# Altium schematic sheet 06-CM4_USB_HDMI_SDCard.SchDoc
size B; SheetNumber: 6; SheetTotal: 11
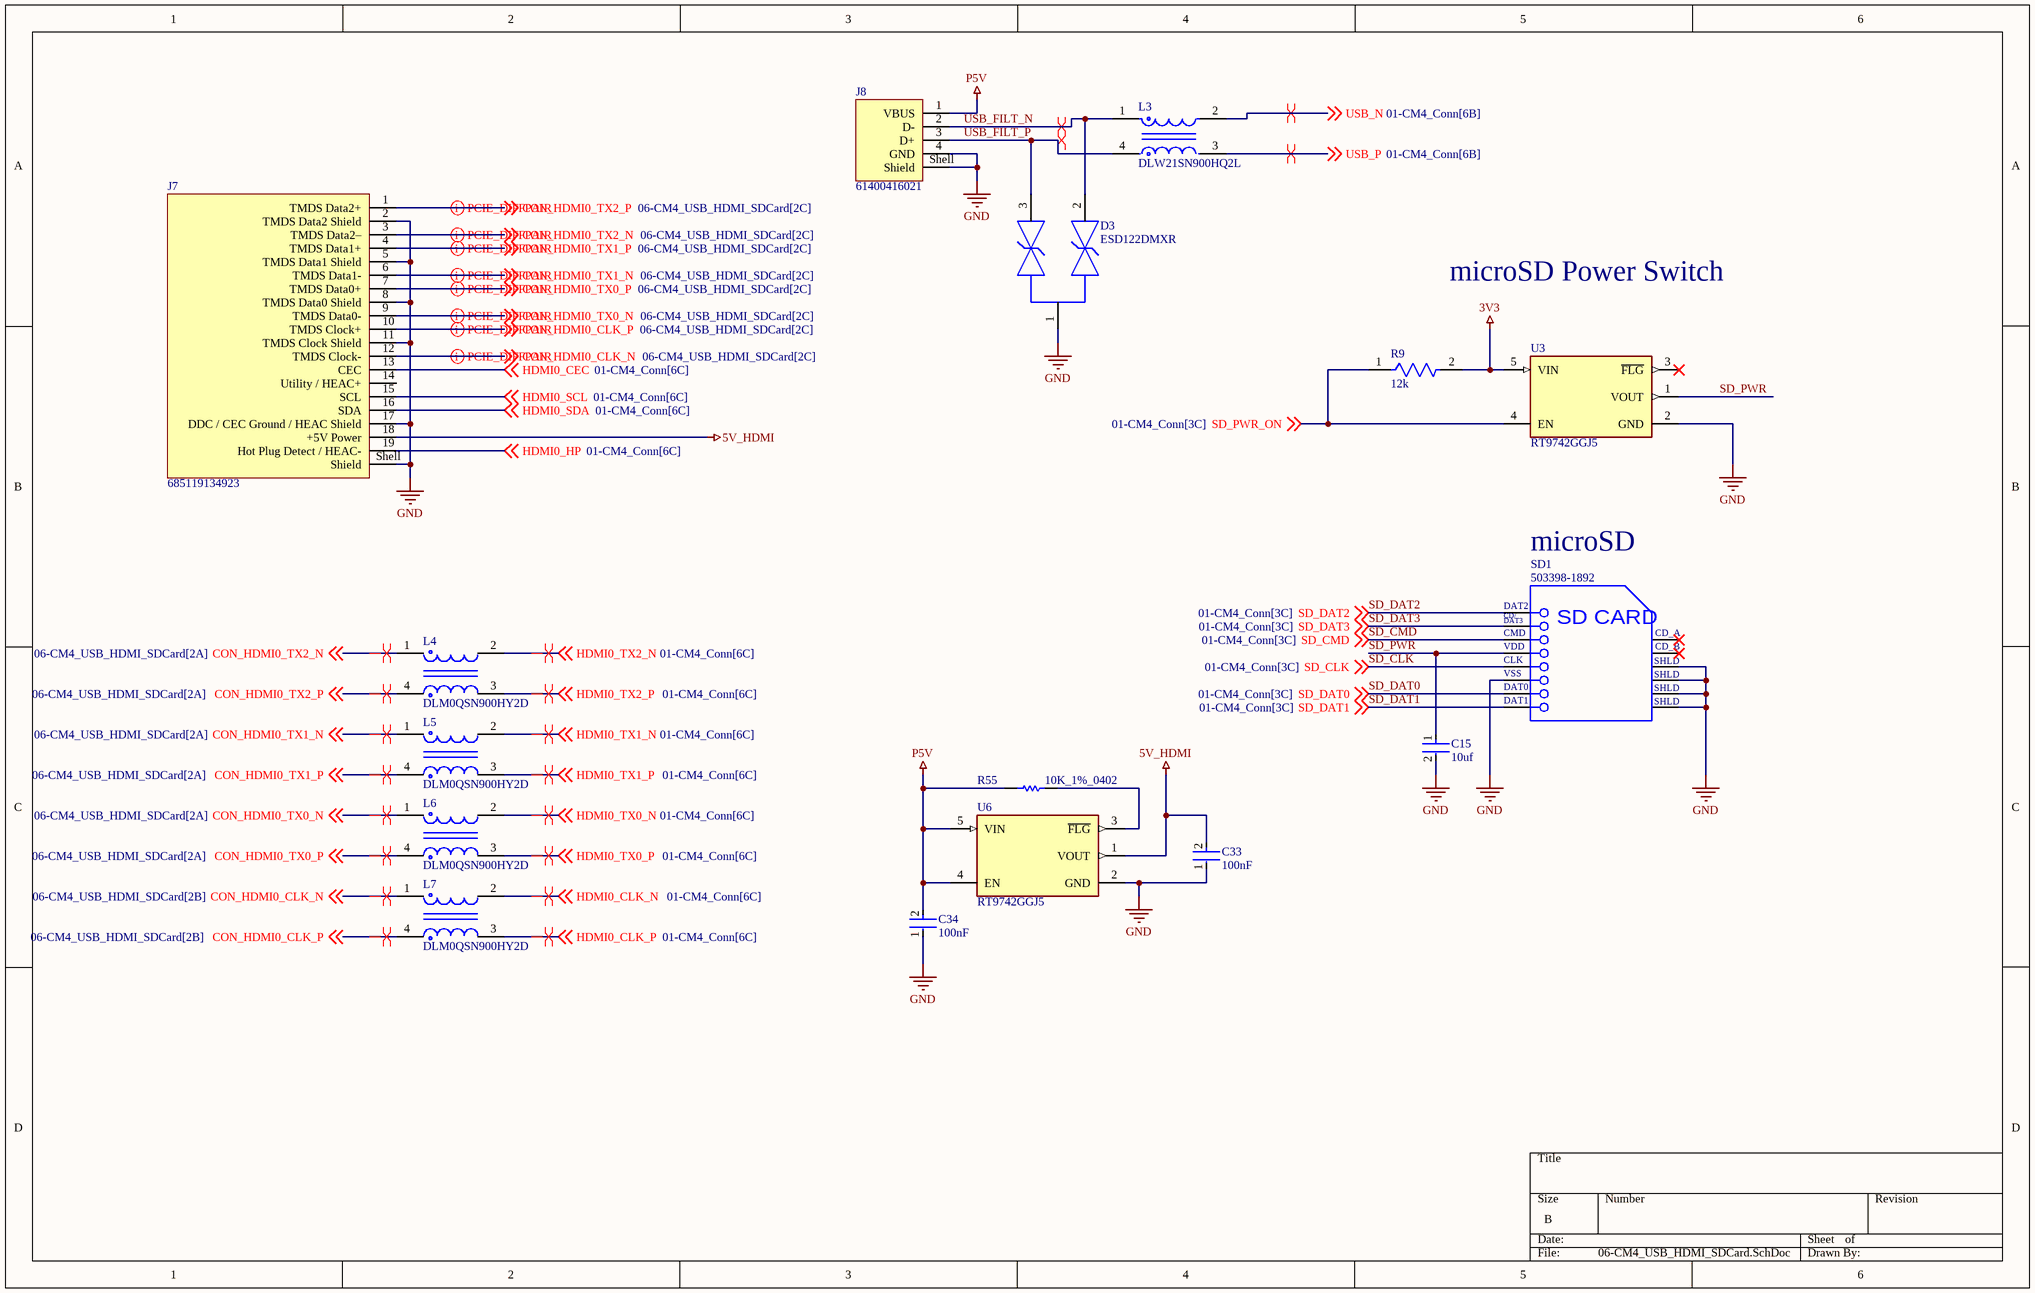
[diagram p0: 06-CM4_USB_HDMI_SDCard.SchDoc]

## Parts
C15  10uf  [FP-GRM188-0_2-IPC_C]
C33  100nF  [FP-GRM15-MFG]
C34  100nF  [FP-GRM15-MFG]
D3  ESD122DMXR  [FP-DMX0003A-MFG]
J7  685119134923  [685119134923]
J8  61400416021  [61400416021]
L3  DLW21SN900HQ2L  [FP-DLW21S-MFG]
L4  DLM0QSN900HY2D  [FP-DLM0Q-MFG]
L5  DLM0QSN900HY2D  [FP-DLM0Q-MFG]
L6  DLM0QSN900HY2D  [FP-DLM0Q-MFG]
L7  DLM0QSN900HY2D  [FP-DLM0Q-MFG]
R9  12k  [FP-RC0402-0_4-IPC_C]
R55  10K_1%_0402  [RESC1005X40X25NL10T10]
SD1  503398-1892  [MOLX-503398-1892_V]
U3  RT9742GGJ5  [FP-RT9742GGJ5-IPC_C]
U6  RT9742GGJ5  [FP-RT9742GGJ5-IPC_C]

## Nets
3V3: R9.2 U3.5(VIN)
5V_HDMI: C33.2 J7.18(+5V_Power) U6.1(VOUT)
GND: C15.2 C33.1 C34.1 D3.1(GND) J7.2(TMDS_Data2_Shield) J7.5(TMDS_Data1_Shield) J7.8(TMDS_Data0_Shield) J7.11(TMDS_Clock_Shield) J7.17(DDC_/_CEC_Ground_/_HEAC_Shield) J7.Shell(Shield) J8.4(GND) J8.Shell(Shield) SD1.6(VSS) SD1.11(SHLD) SD1.12(SHLD) SD1.13(SHLD) SD1.14(SHLD) U3.2(GND) U6.2(GND)
P5V: C34.2 J8.1(VBUS) R55.1 U6.4(EN) U6.5(VIN)
CON_HDMI0_CLK_N: J7.12(TMDS_Clock-) L7.1 ; off-sheet CON_HDMI0_CLK_N
CON_HDMI0_CLK_P: J7.10(TMDS_Clock+) L7.4 ; off-sheet CON_HDMI0_CLK_P
CON_HDMI0_TX0_N: J7.9(TMDS_Data0-) L6.1 ; off-sheet CON_HDMI0_TX0_N
CON_HDMI0_TX0_P: J7.7(TMDS_Data0+) L6.4 ; off-sheet CON_HDMI0_TX0_P
CON_HDMI0_TX1_N: J7.6(TMDS_Data1-) L5.1 ; off-sheet CON_HDMI0_TX1_N
CON_HDMI0_TX1_P: J7.4(TMDS_Data1+) L5.4 ; off-sheet CON_HDMI0_TX1_P
CON_HDMI0_TX2_N: J7.3(TMDS_Data2–) L4.1 ; off-sheet CON_HDMI0_TX2_N
CON_HDMI0_TX2_P: J7.1(TMDS_Data2+) L4.4 ; off-sheet CON_HDMI0_TX2_P
HDMI0_CEC: J7.13(CEC) ; off-sheet HDMI0_CEC
HDMI0_CLK_N: L7.2 ; off-sheet HDMI0_CLK_N
HDMI0_CLK_P: L7.3 ; off-sheet HDMI0_CLK_P
HDMI0_HP: J7.19(Hot_Plug_Detect_/_HEAC-) ; off-sheet HDMI0_HP
HDMI0_SCL: J7.15(SCL) ; off-sheet HDMI0_SCL
HDMI0_SDA: J7.16(SDA) ; off-sheet HDMI0_SDA
HDMI0_TX0_N: L6.2 ; off-sheet HDMI0_TX0_N
HDMI0_TX0_P: L6.3 ; off-sheet HDMI0_TX0_P
HDMI0_TX1_N: L5.2 ; off-sheet HDMI0_TX1_N
HDMI0_TX1_P: L5.3 ; off-sheet HDMI0_TX1_P
HDMI0_TX2_N: L4.2 ; off-sheet HDMI0_TX2_N
HDMI0_TX2_P: L4.3 ; off-sheet HDMI0_TX2_P
SD_CLK: SD1.5(CLK) ; off-sheet SD_CLK
SD_CMD: SD1.3(CMD) ; off-sheet SD_CMD
SD_DAT0: SD1.7(DAT0) ; off-sheet SD_DAT0
SD_DAT1: SD1.8(DAT1) ; off-sheet SD_DAT1
SD_DAT2: SD1.1(DAT2) ; off-sheet SD_DAT2
SD_DAT3: SD1.2(CD/DAT3) ; off-sheet SD_DAT3
SD_PWR: C15.1 SD1.4(VDD) U3.1(VOUT)
SD_PWR_ON: R9.1 U3.4(EN) ; off-sheet SD_PWR_ON
USB_FILT_N: D3.2(IO1) J8.2(D-) L3.1
USB_FILT_P: D3.3(IO2) J8.3(D+) L3.4
USB_N: L3.2 ; off-sheet USB_N
USB_P: L3.3 ; off-sheet USB_P
NetR55_2: R55.2 U6.3(~{FLG})

Not connected (* = marked no-connect by the designer): J7 14(Utility_/_HEAC+); SD1 9(CD_A)* 10(CD_B)*; U3 3(~{FLG})*

## Layout directives
differential pair; differential pair class HDMI: CON_HDMI0_CLK_N, CON_HDMI0_CLK_P, CON_HDMI0_TX0_N, CON_HDMI0_TX0_P, CON_HDMI0_TX1_N, CON_HDMI0_TX1_P, CON_HDMI0_TX2_N, CON_HDMI0_TX2_P
differential pair: CON_HDMI0_CLK_N, CON_HDMI0_CLK_P, CON_HDMI0_TX0_N, CON_HDMI0_TX0_P, CON_HDMI0_TX1_N, CON_HDMI0_TX1_P, CON_HDMI0_TX2_N, CON_HDMI0_TX2_P, HDMI0_CLK_N, HDMI0_CLK_P, HDMI0_TX0_N, HDMI0_TX0_P, HDMI0_TX1_N, HDMI0_TX1_P, HDMI0_TX2_N, HDMI0_TX2_P, USB_FILT_N, USB_FILT_P, USB_N, USB_P

## Notes on the sheet
- microSD Power Switch
- microSD
- (in symbol CMP-2000-05621-1) CD/; DAT3; SD CARD

## Library data of the parts
C15 = CMP-06035-045466-1: Chip Multilayer Ceramic Capacitors for General Purpose, 0603, 10uF, X5R, 15%, 20%, 35V; Case Code (Imperial): 0603; Voltage Rating (DC): 35V; Width: 0.031inch; Dielectric: X5R; Voltage Rating: 35V; Min Operating Temperature: -55°C; Thickness: 0.039inch; Mount: Surface Mount; Case/Package: 0603; Length: 0.063inch; Capacitance: 10uF; Max Operating Temperature: 85°C; Packaging: Tape and Reel; Tolerance: 20%; Case Code (Metric): 1608
C33 C34 = CMP-2100-03641-2: CAP CER 0.1UF 16V X7R 0402; Manufacturer Part Number: GRM155R71C104KA88D; Manufacturer: Murata; Standoff Height: 0mm; Tolerance: 10%; Voltage Rating: 16Vdc; Material: Ceramic; Capacitance: 0.10μF; Value: 0.10μF; RoHS: TRUE; Temperature Characteristic: X7R; Octopart: https://octopart.com/grm155r71c104ka88d-murata-196880; Digikey Description: CAP CER 0.1UF 16V X7R 0402; Device Class L3: Ceramic Capacitors; Height: 0.55mm; ComponentLink2Description: Datasheet; Temperature Range Low: -55°C; Ipc Land Pattern Name: CAPC10050X219; ComponentLink2URL: https://search.murata.co.jp/Ceramy/image/img/A01X/G101/ENG/GRM155R71H471KA01-01A.pdf; Device Class L1: Passive Components; Lead Free: yes; Category: Cap; Package: GRM15; Temperature: -55°C to +125°C; Device Class L2: Capacitors; Temperature Range High: +125°C; Mouser Description: 0402 0.1 uF 16V ±10 % Tolerance X7R SMT Multilayer Ceramic Capacitor
D3 = CMP-04989-000013-1: TVS DIODE 3.6V 8.4V 3X2SON; Peak Pulse Power: 20W; Min Breakdown Voltage: 5.1V; Average Rectified Current: 10A; Element Configuration: Common Cathode; Number of Channels: 2; Max Reverse Voltage (DC): 100V; Interface: USB; Power Line Protection: No; Peak Pulse Current: 2.5A; Clamping Voltage: 8.4V; Min Operating Temperature: -40°C; Number of Pins: 3; Resistor Type: Zener; Mount: Through Hole; Case/Package: TO-220-3; Reverse Standoff Voltage: 3.6V; RoHS Compliant: Yes; Max Operating Temperature: 125°C; Number of Bidirectional Channels: 2; Packaging: Rail/Tube
J7 = CMP-1502-00169-3: NexarPartId: 18818285; Connector Type: HDMI; Contact Resistance: 30mΩ; Current Rating: 500mA; Gender: Receptacle; Insulation Resistance: 10MΩ; Number of Contacts: 19; Body Material: Plastic; Voltage Rating: 40V; REACH SVHC: Unknown; Length: 12.15mm; Orientation: Horizontal; Packaging: Tape and Reel; Number of Pins: 19; Min Operating Temperature: -25°C; Termination: SMD/SMT; Height: 5.55mm; Features: Shielded; Number of Positions: 19; Width: 15mm; Mount: Horizontal, Surface Mount; Color: Black; Contact Material: Bronze, Gold; RoHS: Compliant; Max Operating Temperature: 85°C
J8 = CMP-1502-03227-2: NexarPartId: 21041530; Contact Resistance: 20mΩ; Gender: Receptacle; Voltage Rating (DC): 30V; Current Rating: 1.5A; Connector Type: USB; Insulation Resistance: 1GΩ; USB Standard: USB 2.0; Number of Contacts: 4; Number of Ports: 1; Width: 14.4mm; REACH SVHC: Unknown; Contact Plating: Gold; Length: 15.8mm; Lead Free: Lead Free; Max Operating Temperature: 105°C; Orientation: Horizontal; Contact Material: Copper; Voltage Rating: 30V; Min Operating Temperature: -40°C; Flammability Rating: UL94 V-0; Color: White; RoHS: Compliant; Number of Pins: 4; Mount: Horizontal, Through Hole; Number of Positions: 4; Operating Supply Voltage: 30V; Insulation Material: PBT; Termination: Solder
L3 = CMP-2000-06163-2: Common Mode Choke, 0805, 90Ω @ 100MHz, 0.41Ω, 25%, 280mA; Impedance: 90R; Shielding: Unshielded; DC Resistance (DCR): 410mR; Number of Lines: 2; RoHS Compliant: Yes; Series: EMIFIL®, DLW21S; Weight: 0.000388oz; Current Rating: 280mA; Case Code (Imperial): 0805; Termination: SMD/SMT; Lead Free: Lead Free; Width: 0.047inch; Height: 0.055inch; Package Quantity: 1; Radiation Hardening: No; Depth: 1.4mm; Packaging: Tape and Reel; Current: 280mA; REACH SVHC: No SVHC; Test Frequency: 100MHz; DC Current: 280mA; Max Operating Temperature: 85°C; Case/Package: 0805; Min Operating Temperature: -40°C; Max DC Current: 280mA; Tolerance: 25%; Resistor Type: Wirewound; Length: 2mm; Mount: Surface Mount; Military Standard: Not
L4-L7 = CMP-06045-000424-1: Chip Common Mode Choke Coil Monolithic 025020 50mA 90Ohm @ 100MHz; Impedance: 90R; Length: 650um; Width: 500um
R9 = CMP-2002-07378-2: RES SMD 12K OHM 1% 1/16W 0402; Power Rating: 62.5mW; Voltage Rating: 50V; Resistance: 12kR; Max Power Dissipation: 63mW; Temperature Coefficient: 100ppm/°C; Construction: Rectangular; Case Code (Metric): 1005; Package Quantity: 1; Weight: 2.3E-05oz; RoHS Compliant: Yes; Packaging: Tape and Reel; Case Code (Imperial): 0402; Military Standard: Not; Min Operating Temperature: -55°C; Depth: 0.5mm; Length: 1mm; Width: 0.02inch; Termination: SMD/SMT; Lead Free: Lead Free; Tolerance: 1%; REACH SVHC: No SVHC; Size Code: 0402; Resistance Tolerance: 1%; Series: RC; Max Operating Temperature: 155°C; Height: 0.016inch; Features: Moisture Resistant; Number of Terminations: 2; Case/Package: 0402; Resistor Type: Thick Film
R55 = CMP-2002-04694-1: Manufacturer: Bourns; Part Number: CR0402-FX-1002GLF
SD1 = CMP-2000-05621-1: Micro SD Connector, Pitch 1.1 mm, 8 Position, Height 1.4 mm, -25 to 85 degC, RoHS, Tape and Reel; Manufacturer: Molex; Voltage Rating: 10VAC/DC; Current Rating: 500mA; Manufacturer URL: http://www.molex.com/; Package Reference: 503398-1892; Packaging: Reel; RoHS: Details; Brand: Molex; Datasheet URL: http://www.molex.com/pdm_docs/sd/5033981892_sd.pdf; Mounting Technology: SurfaceMount; Factory Pack Quantity: 2400; Datasheet Version: Rev. E, 04/2006; Series: 503398; Product Category: MemoryCardConnectors; Package Description: Micro SD Connector, Pitch 1.1 mm, 8 Position, Height 1.4 mm
U3 U6 = CMP-79883-000001-1: IC PWR SWTCH N-CHAN 1:1 TSOT23-5; Interface: On/Off; Fault Protection: Over Temperature; Max Output Current: 1A; Number of Outputs: 1; Output Configuration: High Side; On-State Resistance: 70mR; REACH SVHC: No SVHC; Number of Pins: 23; Packaging: Tape and Reel; Case/Package: SOT-23-5; RoHS Compliant: Yes; Max Operating Temperature: 85°C; Min Operating Temperature: -40°C